# EAGLE design Dist Monitoring Sensors (EAGLE 9.1.3)
CNAME: ALICAD; CREVISION: 2.0; DESIGNER: Alan Ibbett
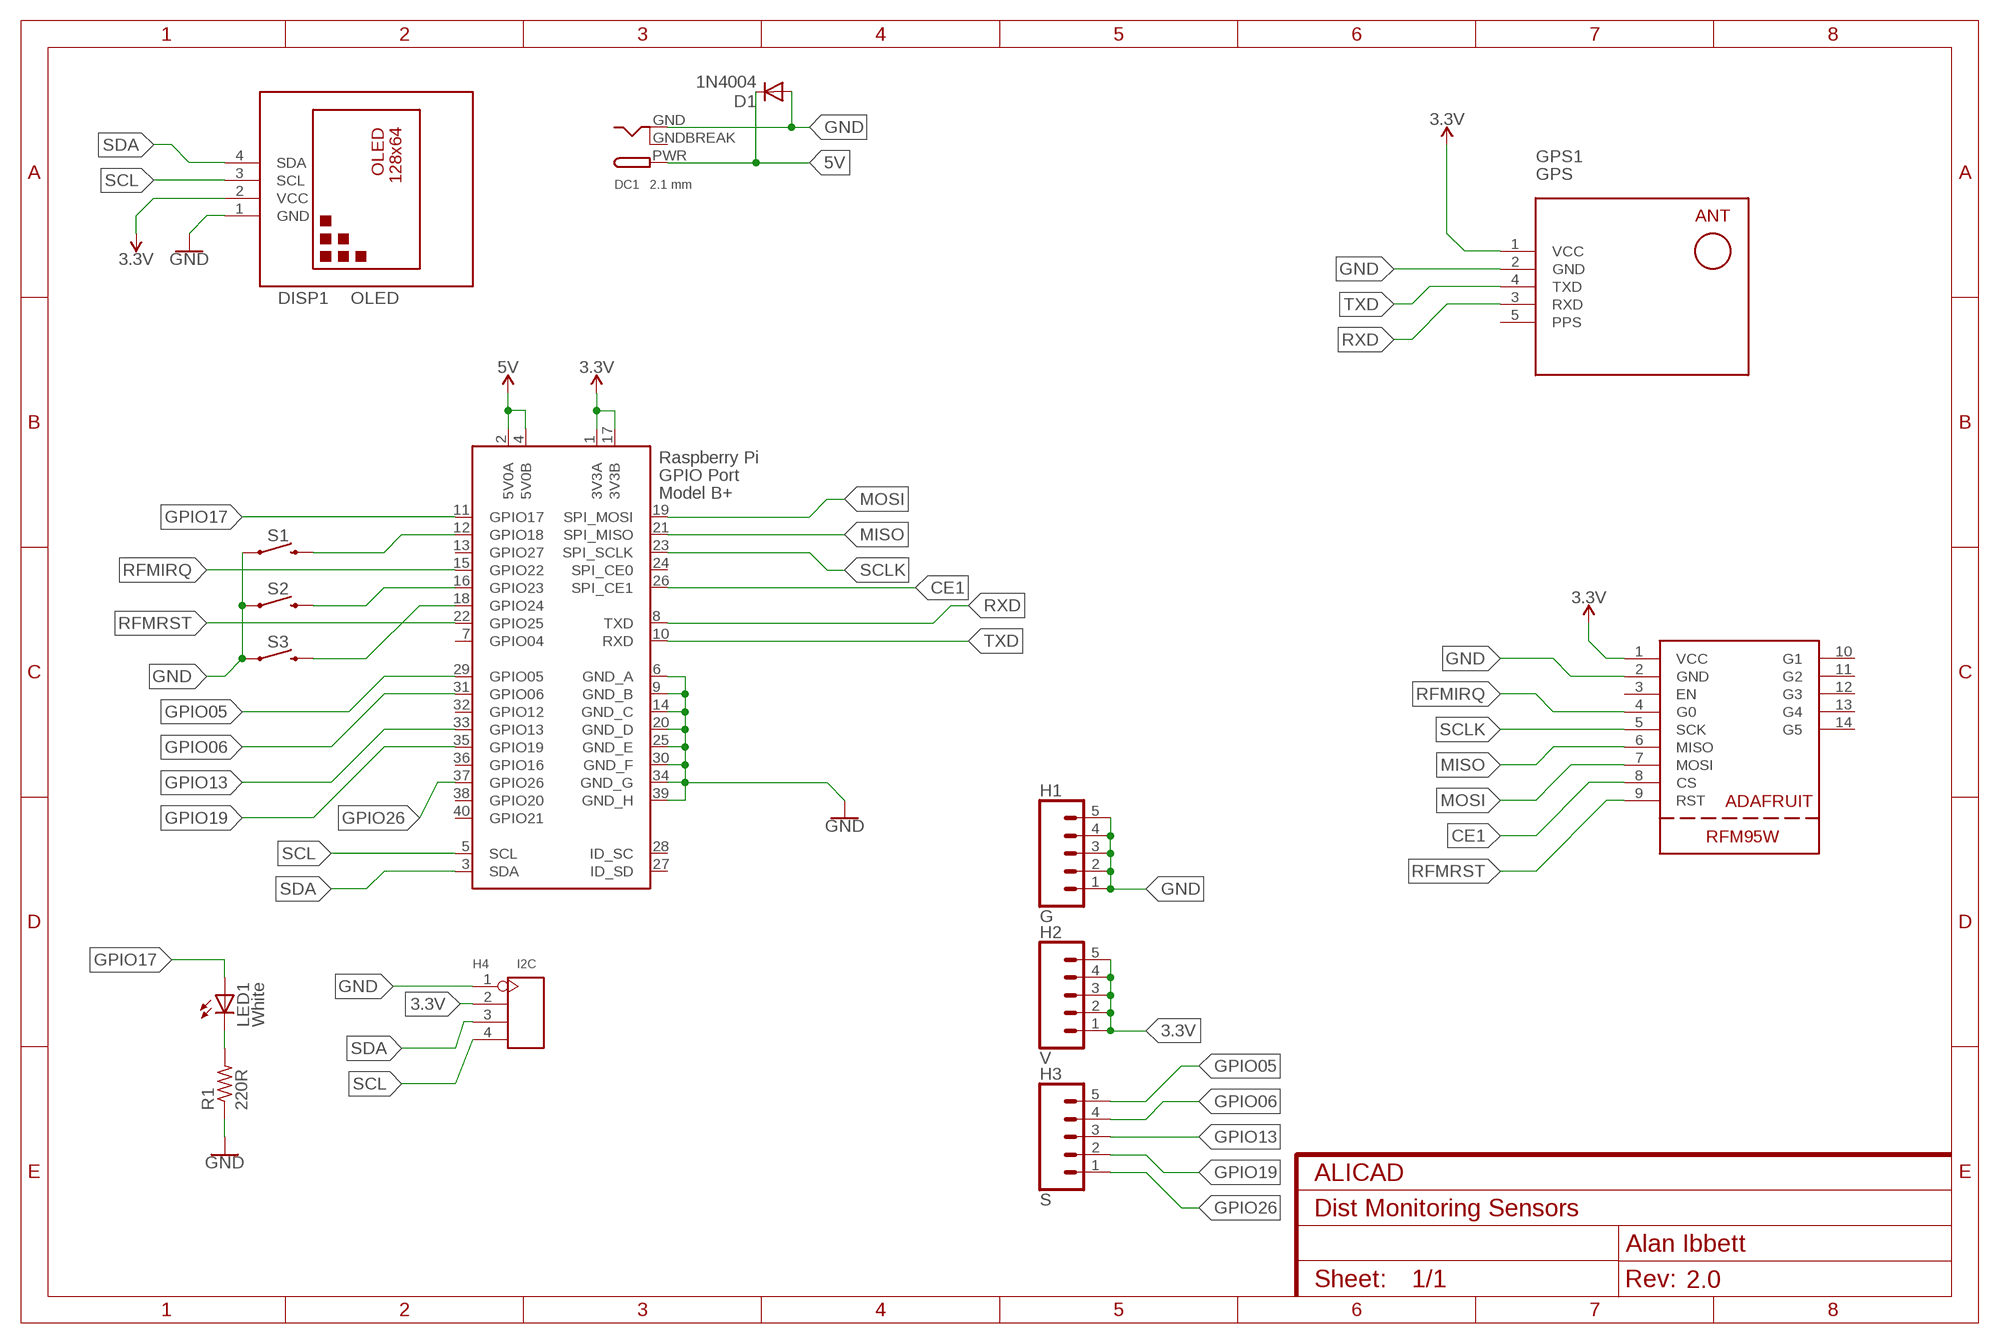
[diagram p0: schematic, sheet 1]

## Parts
D1  1N4004  [DO41-10]
DC1  2.1 mm  DCBARRELPTH  [DCJACK_2MM_PTH]
DISP1  OLED  DISPLAY-OLED-128X64-I2C  [DISPLAY-OLED-128X64-I2C]
GPS1  GPS  GPS-RECEIVER-NEO6MGENERIC  [GPS-RECEIVER-NEO6M-GENERIC]
H1  G  CONN_05  [1X05]
H2  V  CONN_05  [1X05]
H3  S  CONN_05  [1X05]
H4  I2C  DIP-BLACK-MALE-HEADER-VERT(4P-2.54)  [H4-2.54]
LED1  White  LED3MM  [LED3MM]
R1  220R  R-US_0207/10  [0207/10]
S1  MOMENTARY-SWITCH-SPST-PTH-6.0MM  [TACTILE_SWITCH_PTH_6.0MM]
S2  MOMENTARY-SWITCH-SPST-PTH-6.0MM  [TACTILE_SWITCH_PTH_6.0MM]
S3  MOMENTARY-SWITCH-SPST-PTH-6.0MM  [TACTILE_SWITCH_PTH_6.0MM]
U1  RFM95W  [RFM95W]
X1  Raspi 40 Pin Connector  RASPI_BOARD_B+#_E3P  [RASPI_BOARD_B+_EDGES_3DRILL_PAD]

## Nets
3.3V: DISP1.2(VCC) GPS1.1(VCC) H2.1 H2.2 H2.3 H2.4 H2.5 H4.2 U1.1(VCC) X1.1(3V3A) X1.17(3V3B)
5V: D1.C DC1.PWR X1.2(5V0A) X1.4(5V0B)
CE1: U1.8(CS) X1.26(SPI_CE1)
GND: D1.A DC1.GND DISP1.1(GND) GPS1.2(GND) H1.1 H1.2 H1.3 H1.4 H1.5 H4.1 R1.1 S1.1 S2.1 S3.1 U1.2(GND) X1.6(GND_A) X1.9(GND_B) X1.14(GND_C) X1.20(GND_D) X1.25(GND_E) X1.30(GND_F) X1.34(GND_G) X1.39(GND_H)
GPIO05: H3.5 X1.29(GPIO05)
GPIO06: H3.4 X1.31(GPIO06)
GPIO13: H3.3 X1.33(GPIO13)
GPIO17: LED1.A X1.11(GPIO17)
GPIO18: S1.3 X1.12(GPIO18)
GPIO19: H3.2 X1.35(GPIO19)
GPIO23: S2.3 X1.16(GPIO23)
GPIO24: S3.3 X1.18(GPIO24)
GPIO26: H3.1 X1.37(GPIO26)
MISO: U1.6(MISO) X1.21(SPI_MISO)
MOSI: U1.7(MOSI) X1.19(SPI_MOSI)
N$1: LED1.K(C) R1.2
RFMIRQ: U1.4(G0) X1.15(GPIO22)
RFMRST: U1.9(RST) X1.22(GPIO25)
RXD: GPS1.3(RXD) X1.8(TXD)
SCL: DISP1.3(SCL) H4.4 X1.5(SCL)
SCLK: U1.5(SCK) X1.23(SPI_SCLK)
SDA: DISP1.4(SDA) H4.3 X1.3(SDA)
TXD: GPS1.4(TXD) X1.10(RXD)
Unconnected: GPS1.5(PPS) U1.3(EN) U1.10(G1) U1.11(G2) U1.12(G3) U1.13(G4) U1.14(G5) X1.7(GPIO04) X1.13(GPIO27) X1.24(SPI_CE0) X1.27(ID_SD) X1.28(ID_SC) X1.32(GPIO12) X1.36(GPIO16) X1.38(GPIO20) X1.40(GPIO21)

## Power pins joined to a net without a drawn wire
GNDBREAK: DC1.GNDBREAK

## Library data of the parts
D1 = adafruit:1N4004: DIODE General purpose 1N400x type rectifier (With bigger pads) http://www.ladyada.net/library/pcb/eaglelibrary.html
DC1 = adafruit:DCBARREL: 2.0mm DC Barrel Jack DCJACK_2MM_PTH - Through Hole Jack (4UConnector: 05537)
DISP1 = Alicad:DISPLAY-OLED-128X64-I2C: 128x64 Dot Matrix OLED Module based on SSD1306 chip Variant with I2C interface More details available here: http://www.instructables.com/id/Monochrome-096-i2c-OLED-display-with-arduino-SSD13/ SSD1306 datasheet: https://cdn-shop.adafruit.com/datasheets/SSD1306.pdf Click here to find device on ebay.com <http://www.ebay.com/sch/oled+display+128x64+iic> Note: There are two variants: I2C and SPI. Search for the proper version.
GPS1 = Alicad:GPS-RECEIVER-NEO6M: Generic GPS Receiver Module based on NEO-6 device This is based on the Generic UBLOX Chinese modules.
H1-H3 = SparkFun-Connectors:CONN_05: Multi connection point. Often used as Generic Header-pin footprint for 0.1 inch spaced/style header connections On any of the 0.1 inch spaced packages, you can populate with these: Break Away Headers - Straight <https://www.sparkfun.com/products/116> (PRT-00116) Break Away Male Headers - Right Angle <https://www.sparkfun.com/products/553> (PRT-00553) Female Headers <https://www.sparkfun.com/products/115> (PRT-00115) Break Away Headers - Machine Pin <https://www.sparkfun.com/products/117> (PRT-00117) Break Away Female Headers - Swiss Machine Pin <https://www.sparkfun.com/products/743> (PRT-00743) For SCREWTERMINALS and SPRING TERMINALS visit here: Screw Terimnals on SparkFun.com <https://www.sparkfun.com/search/results?term=Screw+Terminals> (5mm/3.5mm/2.54mm spacing) This device is also useful as a general connection point to wire up your design to another part of your project. Our various solder wires solder well into these plated through hole pads. Hook-Up Wire - Assortment (Stranded, 22 AWG) <https://www.sparkfun.com/products/11375> (PRT-11375) Hook-Up Wire - Assortment (Solid Core, 22 AWG) <https://www.sparkfun.com/products/11367> (PRT-11367) View the entire wire category on our website here <https://www.sparkfun.com/categories/141> Special notes: Molex polarized connector foot print use with SKU : PRT-08231 with associated crimp pins and housings. 1MM SMD Version SKU: PRT-10208
H4 = Seeed-Connector:DIP-BLACK-MALE-HEADER-VERT(4P-2.54): 320020017; MPN: P125-1104A0BS116A1; VALUE: 4p-2.54
LED1 = adafruit:LED: LED OSRAM: - CHIPLED LG R971, LG N971, LY N971, LG Q971, LY Q971, LO R971, LY R971 LH N974, LH R974 LS Q976, LO Q976, LY Q976 LO Q996 - Hyper CHIPLED LW Q18S LB Q993, LB Q99A, LB R99A - SideLED LS A670, LO A670, LY A670, LG A670, LP A670 LB A673, LV A673, LT A673, LW A673 LH A674 LY A675 LS A676, LA A676, LO A676, LY A676, LW A676 LS A679, LY A679, LG A679 - Hyper Micro SIDELED® LS Y876, LA Y876, LO Y876, LY Y876 LT Y87S - SmartLED LW L88C, LW L88S LB L89C, LB L89S, LG L890 LS L89K, LO L89K, LY L89K LS L896, LA L896, LO L896, LY L896 - TOPLED LS T670, LO T670, LY T670, LG T670, LP T670 LSG T670, LSP T670, LSY T670, LOP T670, LYG T670 LG T671, LOG T671, LSG T671 LB T673, LV T673, LT T673, LW T673 LH T674 LS T676, LA T676, LO T676, LY T676, LB T676, LH T676, LSB T676, LW T676 LB T67C, LV T67C, LT T67C, LS T67K, LO T67K, LY T67K, LW E67C LS E67B, LA E67B, LO E67B, LY E67B, LB E67C, LV E67C, LT E67C LW T67C LS T679, LY T679, LG T679 LS T770, LO T770, LY T770, LG T770, LP T770 LB T773, LV T773, LT T773, LW T773 LH T774 LS E675, LA E675, LY E675, LS T675 LS T776, LA T776, LO T776, LY T776, LB T776 LHGB T686 LT T68C, LB T68C - Hyper Mini TOPLED® LB M676 - Mini TOPLED Santana® LG M470 LS M47K, LO M47K, LY M47K Source: http://www.osram.convergy.de/
R1 = adafruit:R-US_: RESISTOR, American symbol
S1-S3 = SparkFun-Switches:MOMENTARY-SWITCH-SPST: Momentary Switch (Pushbutton) - SPST Normally-open (NO) SPST momentary switches (buttons, pushbuttons). Variants PTH-12MM - 12mm square, through-hole Momentary Pushbutton Switch - 12mm Square <https://www.sparkfun.com/products/9190> (COM-09190) PTH-6.0MM, PTH-6.0MM-KIT - 6.0mm square, through-hole Mini Pushbutton Switch <https://www.sparkfun.com/products/97> (COM-00097) KIT package intended for soldering kit's - only one side of pads' copper is exposed. PTH-RIGHT-ANGLE-KIT - Right-angle, through-hole Right Angle Tactile Button <https://www.sparkfun.com/products/10791> - Used on SparkFun BigTime Watch Kit <https://www.sparkfun.com/products/11734> SMD-12MM - 12mm square, surface-mount Tactile Button - SMD (12mm) <https://www.sparkfun.com/products/12993> (COM-12993) Used on SparkFun PicoBoard <https://www.sparkfun.com/products/11888> SMD-4.5MM - 4.5mm Square Trackball Switch Used on SparkFun Blackberry Trackballer Breakout <https://www.sparkfun.com/products/13169> SMD-4.6MMX2.8MM - 4.60mm x 2.80mm, surface mount Used on SparkFun SAMD21 Mini Breakout <https://www.sparkfun.com/products/13664> SMD-5.2MM, SMD-5.2-REDUNDANT - 5.2mm square, surface-mount Mini Pushbutton Switch - SMD <https://www.sparkfun.com/products/8720> (COM-08720) Used on Arduino Pro Mini <https://www.sparkfun.com/products/11114> REDUNDANT package connects both switch circuits together SMD-6.0X3.5MM - 6.0 x 3.5mm, surface mount Momentary Reset Switch SMD <https://www.sparkfun.com/products/8229> (COM-08229) SMD-6.2MM-TALL - 6.2mm square, surface mount Tactile Button - SMD (6mm) <https://www.sparkfun.com/products/12992> Used on SparkFun Digital Sandbox <https://www.sparkfun.com/products/12651> SMD-RIGHT-ANGLE - Right-angle, surface mount Used on SparkFun Block for Intel® Edison - Arduino <https://www.sparkfun.com/products/13036>; PROD_ID: SWCH-08441; SF_SKU: COM-00097
U1 = Alicad:RFM95W: Adafruit LORA Packet Radio
X1 = raspberrypi_bastelstube_v13:RASPI_BOARD_B+#: Raspberry Pi GPIO connector with markings for the outer dimensions of the Raspberry Pi board model B+ with different sets of drill holes or mounting pads All pins connected

## Board
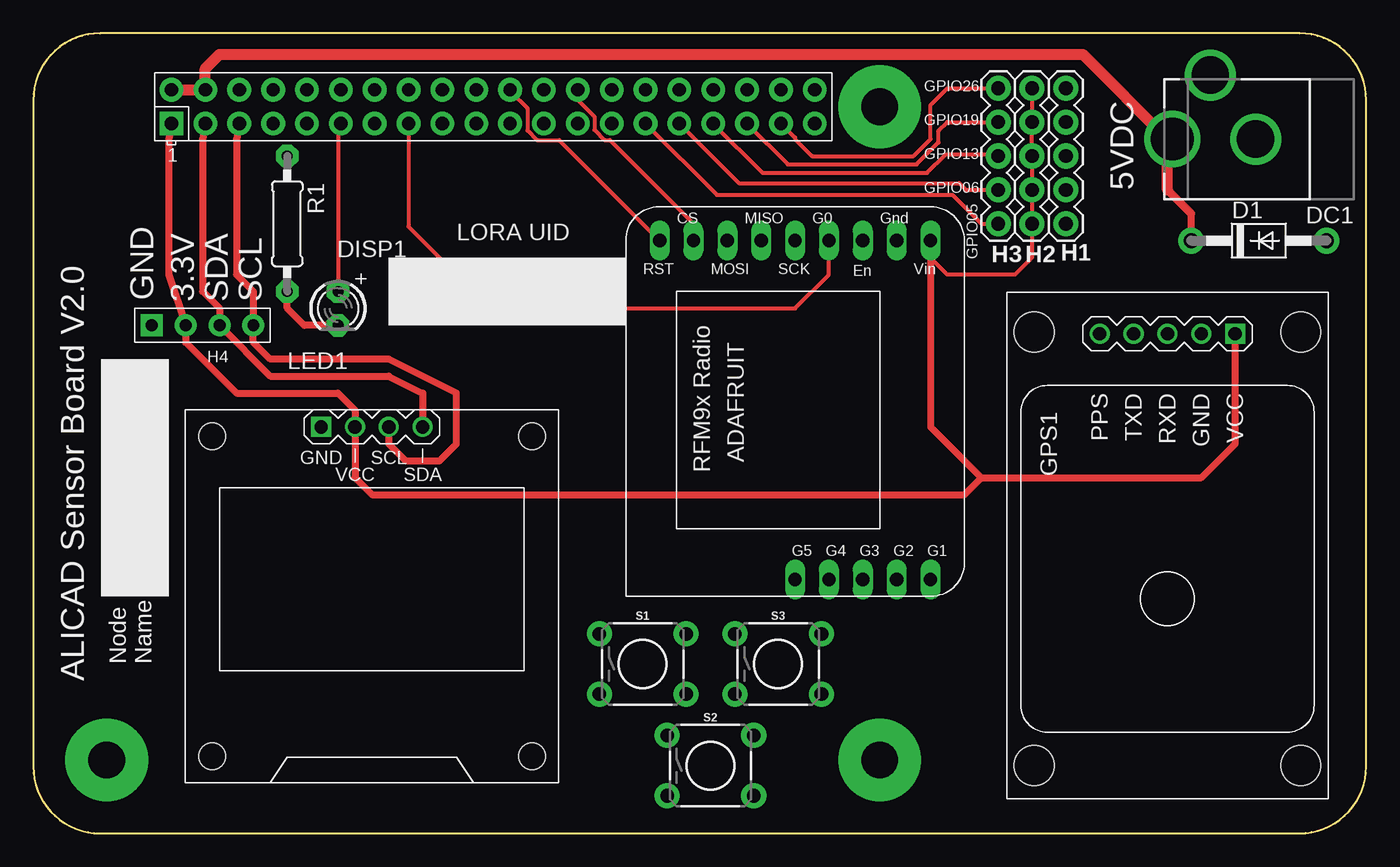
[diagram p1: board, top side]
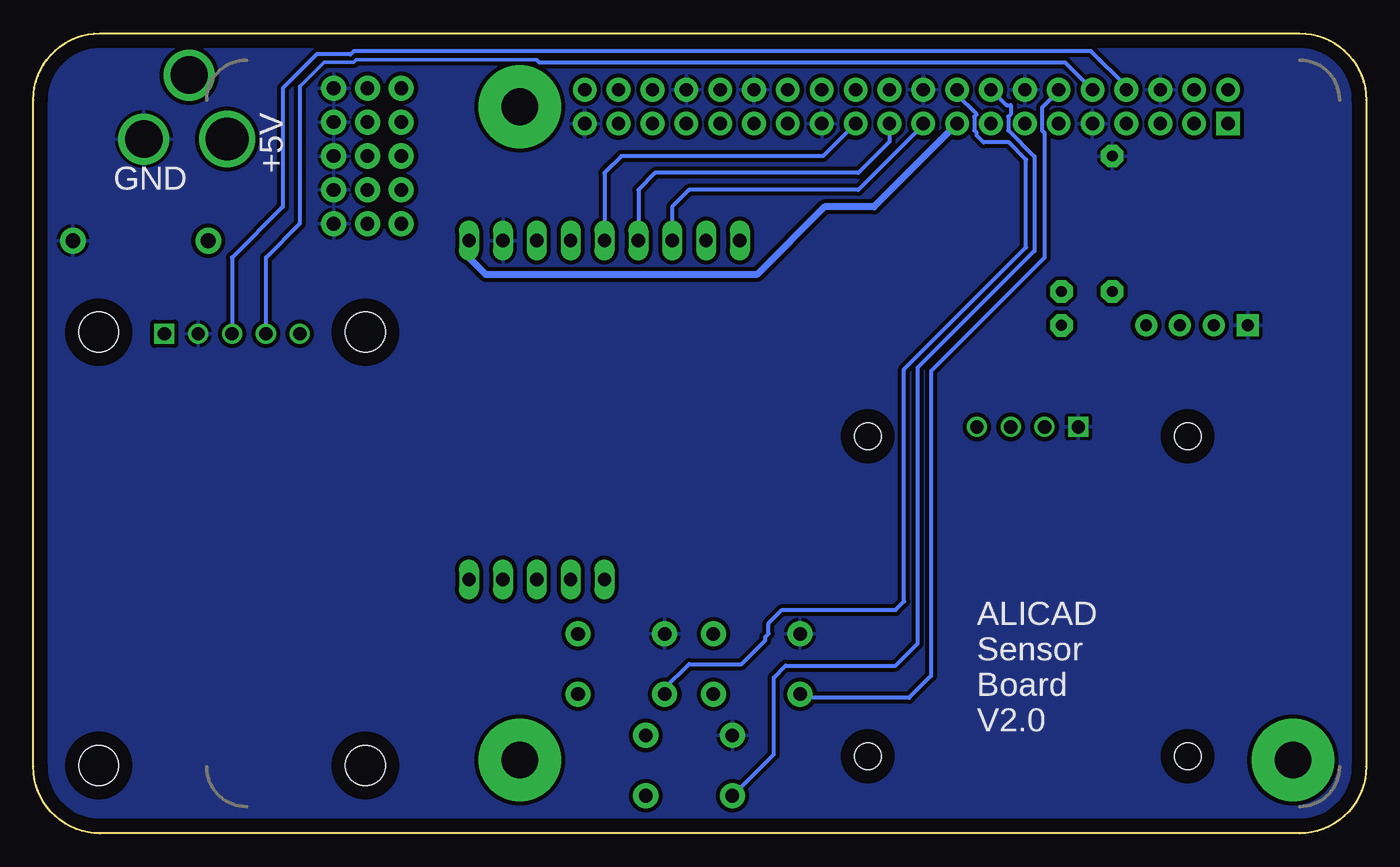
[diagram p2: board, bottom side, seen from below]

Size 100 x 60 mm. Coordinates in mm from the lower left corner, seen from the top.
Outline: 100,5 100,55 arc90 95,60 5,60 arc90 0,55 0,5 arc90 5,0 95,0 arc90 100,5
Copper layers (1*16): Top 0.035mm / dielectric 1.5mm / Bottom 0.035mm
Design rules "alicaddru *": minimum track width 6mil, minimum drill 0.35mm, track to track 12mil, track to pad 8mil, pad to pad 12mil, via to via 12mil, smd to smd 6mil, copper to edge 40mil, drill to drill 6mil, minimum pad ring 10mil, minimum via ring 8mil, stop-mask expansion 4mil, vias tented up to drill 0mil, thermal gap 10mil

### Footprints (pad centres in the part's own frame; a part is rotated, then mirrored left to right if it is on the bottom)
DO41-10 = drill 1.118 pad 1.93: A 5.08,0; C -5.08,0
DCJACK_2MM_PTH = drill 2.8: GND 0,7.35; GNDBREAK 4.8,10.75 | drill 3.2: PWR 0,13.6
DISPLAY-OLED-128X64-I2C = drill 1 square: 1 -3.81,12.7 | drill 1: 2 -1.27,12.7; 3 1.27,12.7; 4 3.81,12.7 | hole 2: -12,12; 12,12; 12,-12; -12,-12
GPS-RECEIVER-NEO6M-GENERIC = drill 1 square: 1 -15.875,5.08 | drill 1: 2 -15.875,2.54; 3 -15.875,0; 4 -15.875,-2.54; 5 -15.875,-5.08 | hole 3: -16,10; -16,-10; 16.5,-10; 16.5,10
1X05 = drill 1.016 pad 1.88: 1 0,0; 2 2.54,0; 3 5.08,0; 4 7.62,0; 5 10.16,0
H4-2.54 = drill 0.889 pad 1.651 square: 1 0,3.81 | drill 0.889 pad 1.651: 2 0,1.27; 3 0,-1.27; 4 0,-3.81
LED3MM = drill 0.813 pad 1.676 octagon: A -1.27,0; K 1.27,0
0207/10 = drill 0.813 pad 1.676 octagon: 1 -5.08,0; 2 5.08,0
TACTILE_SWITCH_PTH_6.0MM = drill 1.016 pad 1.88: 1 -3.251,2.261; 2 3.251,2.261; 3 -3.251,-2.261; 4 3.251,-2.261
RFM95W = drill 1 long: 1 2.54,2.54; 2 5.08,2.54; 3 7.62,2.54; 4 10.16,2.54; 5 12.7,2.54; 6 15.24,2.54; 7 17.78,2.54; 8 20.32,2.54; 9 22.86,2.54; 10 2.54,27.94; 11 5.08,27.94; 12 7.62,27.94; 13 10.16,27.94; 14 12.7,27.94
RASPI_BOARD_B+_EDGES_3DRILL_PAD = drill 1 pad 1.778 square: 1 8.37,51.23 | drill 1 pad 1.778: 2 8.37,53.77; 3 10.91,51.23; 4 10.91,53.77; 5 13.45,51.23; 6 13.45,53.77; 7 15.99,51.23; 8 15.99,53.77; 9 18.53,51.23; 10 18.53,53.77; 11 21.07,51.23; 12 21.07,53.77; 13 23.61,51.23; 14 23.61,53.77; 15 26.15,51.23; 16 26.15,53.77; 17 28.69,51.23; 18 28.69,53.77; 19 31.23,51.23; 20 31.23,53.77; 21 33.77,51.23; 22 33.77,53.77; 23 36.31,51.23; 24 36.31,53.77; 25 38.85,51.23; 26 38.85,53.77; 27 41.39,51.23; 28 41.39,53.77; 29 43.93,51.23; 30 43.93,53.77; 31 46.47,51.23; 32 46.47,53.77; 33 49.01,51.23; 34 49.01,53.77; 35 51.55,51.23; 36 51.55,53.77; 37 54.09,51.23; 38 54.09,53.77; 39 56.63,51.23; 40 56.63,53.77 | drill 2.75 pad 6.2: 41 3.5,3.5; 42 61.5,3.5; 43 61.5,52.5

### Placement (x,y rotation side)
D1  91.95,44.45 0 top
DC1  99.06,52.07 90 top
DISP1  25.4,17.78 0 top
GPS1  85.09,21.59 270 top
H1  77.47,45.72 90 top
H2  74.93,45.72 90 top
H3  72.39,55.88 270 top
H4  12.7,38.1 90 top
LED1  22.86,39.37 270 top
R1  19.05,45.72 270 top
S1  45.72,12.7 0 top
S2  50.8,5.08 0 top
S3  55.88,12.7 0 top
U1  69.85,46.99 180 top
X1  2,2 0 top

### Tracks (layer width: path | path; a pad name or v marks a point on that pad's centre or on a via)
3.3V
  Top 0.305: H2.5 H2.4 H2.3 H2.2 H2.1 74.93,43.18 73.66,41.91 68.58,41.91 67.31,43.18
  Top 0.508: X1.1 10.16,52.07 10.16,41.91 H4.2 11.43,36.83 15.24,33.02 22.86,33.02 24.13,31.75 DISP1.2 24.13,26.67 25.4,25.4 69.85,25.4 71.12,26.67 | U1.1 67.31,43.18 67.31,30.48 71.12,26.67 | 71.12,26.67 87.63,26.67 90.17,29.21 GPS1.1
  Bottom 0.508: X1.17 36.93,46.99 40.64,46.99 45.72,41.91 66.04,41.91 67.31,43.18 U1.1
5V
  Top 0.152: 85.09,51.7 DC1.PWR
  Top 0.508: D1.C 86.87,46.48
  Top 0.61: 86.87,46.48 85.09,48.26
  Top 0.813: X1.2 X1.4 12.91,57.36 13.97,58.42 78.74,58.42 85.09,52.07 DC1.PWR | 85.09,48.26 85.09,51.7
CE1
  Top 0.305: X1.26 40.85,54.99 42.09,53.75 42.09,52.77 42.87,51.98 43.27,51.98 49.53,45.72 U1.8
GND
  pour Bottom: -2.54,59.69 -2.54,0 101.6,0 101.6,1.27 101.6,60.96 -2.54,60.96
GPIO05
  Top 0.305: X1.29 51.28,47.88 68.96,47.88 71.12,45.72 H3.5
GPIO06
  Top 0.305: X1.31 52.93,48.77 69.47,48.77 69.98,48.26 H3.4
GPIO13
  Top 0.305: X1.33 54.71,49.53 67.06,49.53 68.45,50.93 72.26,50.93 H3.3
GPIO17
  Top 0.305: X1.11 22.86,53.02 LED1.A
GPIO18
  Bottom 0.305: X1.12 23.07,55.67 24.32,54.42 24.32,52.71 24.13,52.53 24.13,43.18 32.64,34.67 32.64,11.81 34.29,10.16 42.19,10.16 S1.3
GPIO19
  Top 0.305: X1.35 56.62,50.16 66.27,50.16 67.92,51.82 67.92,52.68 68.58,53.34 H3.2
GPIO23
  Bottom 0.305: X1.16 26.99,54.61 26.67,54.61 26.67,53.93 26.86,53.75 26.86,52.71 24.89,50.75 24.89,43.69 33.66,34.92 33.66,14.22 35.31,12.57 43.56,12.57 44.45,11.68 44.45,5.92 S2.3
GPIO24
  Bottom 0.305: S3.3 52.63,10.87 50.8,12.7 46.86,12.7 45.09,14.48 45.09,14.73 44.83,14.99 44.83,15.75 43.81,16.76 35.31,16.76 34.67,17.4 34.67,34.8 25.53,43.94 25.53,50.52 26.82,51.82 28.7,51.82 29.21,52.32 29.21,52.53 29.39,52.71 29.39,53.75 29.21,53.93 30.69,55.41 X1.18
GPIO26
  Top 0.305: X1.37 57.15,52.17 57.15,52.07 58.42,50.8 66.04,50.8 67.31,52.07 67.31,54.61 68.58,55.88 H3.1
MISO
  Bottom 0.305: X1.21 35.77,51.86 38.1,49.53 53.34,49.53 54.61,48.26 U1.6
MOSI
  Bottom 0.305: 33.23,53.13 X1.19 33.23,53.13 | U1.7 52.07,46.99 50.8,48.26 38.1,48.26 33.23,53.13
N$1
  Top 0.508: LED1.K 20.32,38.1 19.05,39.37 R1.2
RFMIRQ
  Top 0.305: X1.15 28.15,45.51 34.29,39.37 57.15,39.37 59.69,41.91 U1.4
RFMRST
  Top 0.305: X1.22 35.77,55.67 37.06,54.38 37.06,52.71 37.79,51.98 39.45,51.98 U1.9
RXD
  Bottom 0.305: GPS1.3 85.09,43.18 81.28,46.99 81.28,55.88 78.74,58.42 76.2,58.42 75.95,58.67 20.64,58.67 17.99,56.02 X1.8
SCL
  Top 0.508: DISP1.3 26.67,29.21 27.94,27.94 30.48,27.94 31.75,29.21 31.75,33.02 26.67,35.56 17.78,35.56 16.51,36.83 H4.4 16.51,40.64 15.24,41.91 15.24,52.07 X1.5
SCLK
  Bottom 0.305: X1.23 40.74,50.8 55.88,50.8 57.15,49.53 U1.5
SDA
  Top 0.508: DISP1.4 29.21,33.02 26.67,34.29 17.78,34.29 H4.3 13.97,39.37 12.7,40.64 12.7,52.07 X1.3
TXD
  Bottom 0.254: 62.23,58.01 75.79,58.01 75.96,57.84 78.18,57.84 80.01,56.01
  Bottom 0.305: X1.10 22.57,57.81 61.78,57.81 62.03,57.81 62.23,58.01 | GPS1.4 82.55,43.18 80.01,45.72 80.01,49.53 80.01,56.01

### Text on the board
tPlace: 5VDC | LORA UID | GND | 3.3V | SDA | SCL | Node / Name
bPlace: +5V | GND
tNames: GPIO26 | GPIO19 | GPIO13 | GPIO06 | GPIO05 | ALICAD Sensor Board V2.0
bNames: ALICAD / Sensor / Board / V2.0